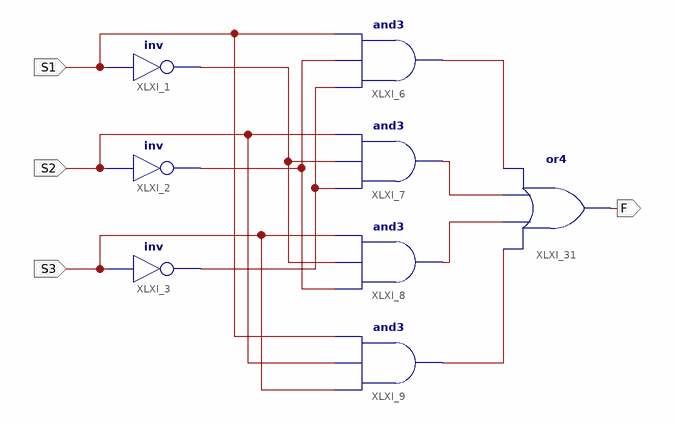
[diagram p0: schematic sheet 1]
// Xilinx ISE schematic LampCtrl.sch (kintex7) as structural Verilog: 8 symbols, 4 ports
module LampCtrl (
  input  S3,
  input  S1,
  input  S2,
  output F
);

  wire NS1, NS2, NS3, XLXN_32, XLXN_33, XLXN_34, XLXN_35;

  not XLXI_1 (NS1, S1);
  not XLXI_2 (NS2, S2);
  not XLXI_3 (NS3, S3);
  and XLXI_6 (XLXN_32, NS3, NS2, S1);
  and XLXI_7 (XLXN_33, NS3, NS1, S2);
  and XLXI_8 (XLXN_34, NS2, NS1, S3);
  and XLXI_9 (XLXN_35, S3, S2, S1);
  or XLXI_31 (F, XLXN_35, XLXN_34, XLXN_33, XLXN_32);
endmodule
